# EAGLE design Triangular Ear Bass 21 (EAGLE 9.6.2)
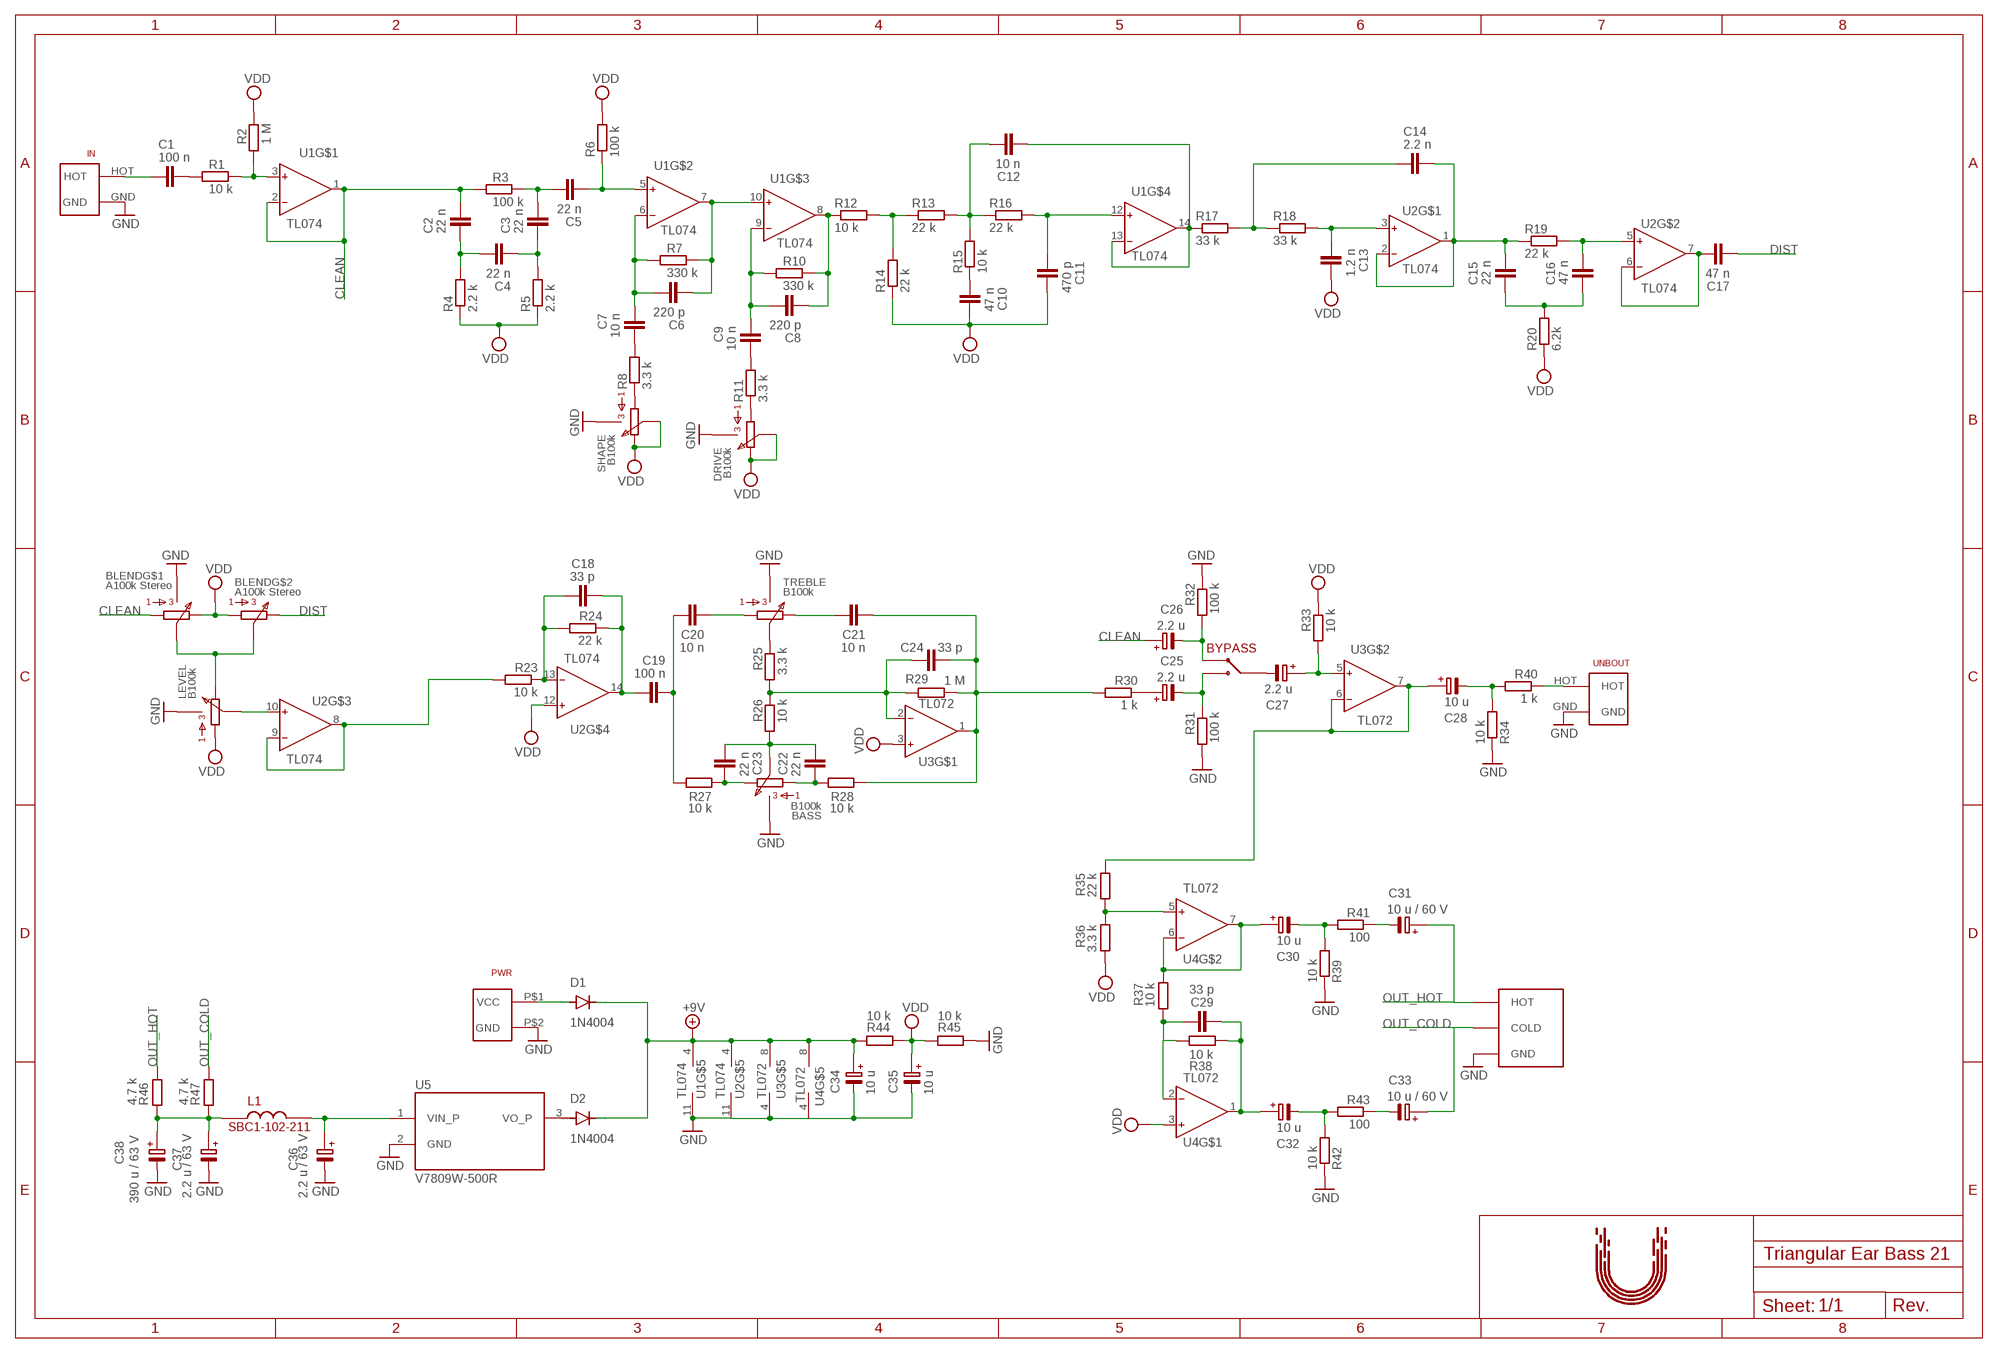
[diagram p0: schematic, sheet 1]

## Parts
BALOUT  HOT_COLD  [HOT_COLD]
BASS  B100k  RK09L1140  [RK09L1140]
BLEND  A100k Stereo  RK09L124000Z  [RK09L124000Z]
BYPASS  BUTTON  [3-HOLES]
C1  100 n  C-EU050-035X075  [C050-035X075]
C2  22 n  C-EU050-035X075  [C050-035X075]
C3  22 n  C-EU050-035X075  [C050-035X075]
C4  22 n  C-EU050-035X075  [C050-035X075]
C5  22 n  C-EU050-035X075  [C050-035X075]
C6  220 p  C-EU050-035X075  [C050-035X075]
C7  10 n  C-EU050-035X075  [C050-035X075]
C8  220 p  C-EU050-035X075  [C050-035X075]
C9  10 n  C-EU050-035X075  [C050-035X075]
C10  47 n  C-EU050-035X075  [C050-035X075]
C11  470 p  C-EU050-035X075  [C050-035X075]
C12  10 n  C-EU050-035X075  [C050-035X075]
C13  1.2 n  C-EU050-035X075  [C050-035X075]
C14  2.2 n  C-EU050-035X075  [C050-035X075]
C15  22 n  C-EU050-035X075  [C050-035X075]
C16  47 n  C-EU050-035X075  [C050-035X075]
C17  47 n  C-EU050-035X075  [C050-035X075]
C18  33 p  C-EU050-035X075  [C050-035X075]
C19  100 n  C-EU050-035X075  [C050-035X075]
C20  10 n  C-EU050-035X075  [C050-035X075]
C21  10 n  C-EU050-035X075  [C050-035X075]
C22  22 n  C-EU050-035X075  [C050-035X075]
C23  22 n  C-EU050-035X075  [C050-035X075]
C24  33 p  C-EU050-035X075  [C050-035X075]
C25  2.2 u  C-PR-2,0X5  [E2,0-5]
C26  2.2 u  C-PR-2,0X5  [E2,0-5]
C27  2.2 u  C-PR-2,0X5  [E2,0-5]
C28  10 u  C-PR-2,0X5  [E2,0-5]
C29  33 p  C-EU050-035X075  [C050-035X075]
C30  10 u  C-PR-2,0X5  [E2,0-5]
C31  10 u / 60 V  C-PR-2,0X5  [E2,0-5]
C32  10 u  C-PR-2,0X5  [E2,0-5]
C33  10 u / 60 V  C-PR-2,0X5  [E2,0-5]
C34  10 u  C-PR-2,0X5  [E2,0-5]
C35  10 u  C-PR-2,0X5  [E2,0-5]
C36  2.2 u / 63 V  C-PR-2,0X5  [E2,0-5]
C37  2.2 u / 63 V  C-PR-2,0X5  [E2,0-5]
C38  390 u / 63 V  C-PR-5,0X12,5  [E5,0-12,5]
D1  1N4004  [DO41-10]
D2  1N4004  [DO41-10]
DRIVE  B100k  RK09L1140  [RK09L1140]
IN  UNBALANCED_INPUT_JACK  [BALANCED_INPUT_JACK]
L1  SBC1-102-211  [SBC1-102-211]
LEVEL  B100k  RK09L1140  [RK09L1140]
PWR  PWR  [PWR]
R1  10 k  R-EU_0204/7  [0204/7]
R2  1 M  R-EU_0204/7  [0204/7]
R3  100 k  R-EU_0204/7  [0204/7]
R4  2.2 k  R-EU_0204/7  [0204/7]
R5  2.2 k  R-EU_0204/7  [0204/7]
R6  100 k  R-EU_0204/7  [0204/7]
R7  330 k  R-EU_0204/7  [0204/7]
R8  3.3 k  R-EU_0204/7  [0204/7]
R10  330 k  R-EU_0204/7  [0204/7]
R11  3.3 k  R-EU_0204/7  [0204/7]
R12  10 k  R-EU_0204/7  [0204/7]
R13  22 k  R-EU_0204/7  [0204/7]
R14  22 k  R-EU_0204/7  [0204/7]
R15  10 k  R-EU_0204/7  [0204/7]
R16  22 k  R-EU_0204/7  [0204/7]
R17  33 k  R-EU_0204/7  [0204/7]
R18  33 k  R-EU_0204/7  [0204/7]
R19  22 k  R-EU_0204/7  [0204/7]
R20  6.2k  R-EU_0204/7  [0204/7]
R23  10 k  R-EU_0204/7  [0204/7]
R24  22 k  R-EU_0204/7  [0204/7]
R25  3.3 k  R-EU_0204/7  [0204/7]
R26  10 k  R-EU_0204/7  [0204/7]
R27  10 k  R-EU_0204/7  [0204/7]
R28  10 k  R-EU_0204/7  [0204/7]
R29  1 M  R-EU_0204/7  [0204/7]
R30  1 k  R-EU_0204/7  [0204/7]
R31  100 k  R-EU_0204/7  [0204/7]
R32  100 k  R-EU_0204/7  [0204/7]
R33  10 k  R-EU_0204/7  [0204/7]
R34  10 k  R-EU_0204/7  [0204/7]
R35  22 k  R-EU_0204/7  [0204/7]
R36  3.3 k  R-EU_0204/7  [0204/7]
R37  10 k  R-EU_0204/7  [0204/7]
R38  10 k  R-EU_0204/7  [0204/7]
R39  10 k  R-EU_0204/7  [0204/7]
R40  1 k  R-EU_0204/7  [0204/7]
R41  100  R-EU_0204/7  [0204/7]
R42  10 k  R-EU_0204/7  [0204/7]
R43  100  R-EU_0204/7  [0204/7]
R44  10 k  R-EU_0204/7  [0204/7]
R45  10 k  R-EU_0204/7  [0204/7]
R46  4.7 k  R-EU_0204/7  [0204/7]
R47  4.7 k  R-EU_0204/7  [0204/7]
SHAPE  B100k  RK09L1140  [RK09L1140]
TREBLE  B100k  RK09L1140  [RK09L1140]
U1  TL074  TL074IDTPDIP-14  [DIP762W53P254L1969H508Q14B]
U2  TL074  TL074IDTPDIP-14  [DIP762W53P254L1969H508Q14B]
U3  TL072  TL072PDIP-8  [DIP762W53P254L980H508Q8B]
U4  TL072  TL072PDIP-8  [DIP762W53P254L980H508Q8B]
U5  V7809W-500R  [CONV_V7809W-500R]
U$1  UTBULT_DESIGN4  [UD_4]
UNBOUT  UNBALANCED_INPUT_JACK  [BALANCED_INPUT_JACK]

## Nets
48V: C37.+ C38.+ L1.P$1 R46.1 R47.1
+9V: C34.+ D1.C D2.C R44.1 U1.4(V+) U2.4(V+) U3.8(V+) U4.8(V+)
BLEND_OUT: R23.2 U2.8(OUT) U2.9(IN-)
CLEAN: BLEND.P$1 C2.2 C26.+ R3.1 U1.1(OUT) U1.2(IN-)
DIST: BLEND.P$8 C17.1
GND: BALOUT.P$1(GND) BASS.P$4 BASS.P$5 BLEND.P$4 BLEND.P$5 C34.- C35.- C36.- C37.- C38.- DRIVE.P$4 DRIVE.P$5 IN.GND LEVEL.P$4 LEVEL.P$5 PWR.P$2(GND) R31.2 R32.1 R34.1 R39.1 R42.1 R45.2 SHAPE.P$4 SHAPE.P$5 TREBLE.P$4 TREBLE.P$5 U1.11(V-) U2.11(V-) U3.4(V-) U4.4(V-) U5.2(GND) UNBOUT.GND
N$1: C1.1 IN.HOT
N$2: C1.2 R1.1
N$3: R1.2 R2.1 U1.3(IN+)
N$4: BLEND.P$2 BLEND.P$7 LEVEL.P$3
N$5: C2.1 C4.2 R4.2
N$6: C3.1 C4.1 R5.2
N$7: C3.2 C5.2 R3.2
N$8: C5.1 R6.1 U1.5(IN+)
N$9: C6.2 C7.1 R7.1 U1.6(IN-)
N$10: C6.1 R7.2 U1.7(OUT) U1.10(IN+)
N$11: C7.2 R8.2
N$12: R8.1 SHAPE.P$1
N$13: C8.2 C9.1 R10.1 U1.9(IN-)
N$14: C8.1 R10.2 R12.1 U1.8(OUT)
N$15: C9.2 R11.2
N$16: DRIVE.P$1 R11.1
N$17: C10.1 R15.1
N$18: R12.2 R13.1 R14.2
N$19: C12.2 R13.2 R15.2 R16.1
N$20: C11.1 R16.2 U1.12(IN+)
N$21: C14.1 R17.2 R18.1
N$22: C12.1 R17.1 U1.13(IN-) U1.14(OUT)
N$23: C13.1 R18.2 U2.3(IN+)
N$24: C14.2 C15.2 R19.1 U2.1(OUT) U2.2(IN-)
N$25: C16.2 R19.2 U2.5(IN+)
N$26: C15.1 C16.1 R20.2
N$29: C17.2 U2.6(IN-) U2.7(OUT)
N$30: LEVEL.P$2 U2.10(IN+)
N$31: C18.2 R23.1 R24.2 U2.13(IN-)
N$32: C18.1 C19.2 R24.1 U2.14(OUT)
N$33: C20.1 TREBLE.P$1
N$34: C21.2 TREBLE.P$3
N$35: C19.1 C20.2 R27.2
N$36: R25.1 TREBLE.P$2
N$37: C24.2 R25.2 R26.1 R29.1 U3.2(IN-)
N$38: BASS.P$3 C23.2 R27.1
N$39: BASS.P$2 C22.1 C23.1 R26.2
N$40: BASS.P$1 C22.2 R28.2
N$41: C25.+ R30.1
N$42: C21.1 C24.1 R28.1 R29.2 R30.2 U3.1(OUT)
N$43: BYPASS.P$3 C25.- R31.1
N$44: BYPASS.P$1 C26.- R32.2
N$45: BYPASS.P$2 C27.-
N$46: C27.+ R33.2 U3.5(IN+)
N$47: C28.+ R35.1 U3.6(IN-) U3.7(OUT)
N$48: C28.- R34.2 R40.2
N$49: R35.2 R36.1 U4.5(IN+)
N$51: C29.2 R37.2 R38.1 U4.2(IN-)
N$53: C30.+ R37.1 U4.6(IN-) U4.7(OUT)
N$54: C30.- R39.2 R41.2
N$55: R40.1 UNBOUT.HOT
N$56: C31.- R41.1
N$57: C29.1 C32.+ R38.2 U4.1(OUT)
N$58: C32.- R42.2 R43.2
N$59: C33.- R43.1
N$60: D1.A PWR.P$1(VCC)
N$61: D2.A U5.3(VO_P)
N$62: C36.+ L1.P$2 U5.1(VIN_P)
OUT_COLD: BALOUT.P$3(COLD) C33.+ R47.2
OUT_HOT: BALOUT.P$2(HOT) C31.+ R46.2
VDD: BLEND.P$3 BLEND.P$6 C10.2 C11.2 C13.2 C35.+ DRIVE.P$2 DRIVE.P$3 LEVEL.P$1 R2.2 R4.1 R5.1 R6.2 R14.1 R20.1 R33.1 R36.2 R44.2 R45.1 SHAPE.P$2 SHAPE.P$3 U2.12(IN+) U3.3(IN+) U4.3(IN+)

## Library data of the parts
BALOUT = connectors:HOT_COLD
BASS DRIVE LEVEL SHAPE TREBLE = passives:RK09L1140: RK09L1140 Potentiometer
BLEND = passives:RK09L124000Z: RK09L1140 Potentiometer
BYPASS = connectors:BUTTON
C1-C24 C29 = passives:C-EU: CAPACITOR, European symbol; SPICEPREFIX: C
C25-C28 C30-C38 = passives:C-PR: POLARIZED ELECTROLYTIC/TANTALUM
D1 D2 = passives:1N4004: DIODE general purpose rectifier, 1 A
IN UNBOUT = connectors:UNBALANCED_INPUT_JACK
L1 = passives:SBC1-102-211: SBC1-102-211 - Inductor 1 mH 210 mA
PWR = connectors:PWR
R1-R8 R10-R20 R23-R47 = passives:R-EU_: RESISTOR, European symbol; SPICEPREFIX: R
U1 U2 = ic:TL074IDT: Low noise JFET quad operational amplifier; LINK: https://eu.mouser.com/ProductDetail/Texas-Instruments/TL074CN?qs=%2Fha2pyFadui04%2FQQ4Z%2F%252B8cpHvrlLCfjGhhp9sdrT5Zo%3D; MPN: TL074CN; SUPPLIER: Mouser
U3 U4 = ic:TL072: Low noise JFET quad operational amplifier; LINK: https://www.mouser.se/ProductDetail/Texas-Instruments/TL072IP?qs=5BZzbFV4k2v7IBrcArRPQw%3D%3D; MPN: TL072IP; SUPPLIER: Mouser
U5 = ic:V7809W-500R: V7809W-500R Power regulator Input up to 72 V, output 9 V 500 mA; LINK: https://eu.mouser.com/ProductDetail/CUI-Inc/V7809W-500R?qs=WyjlAZoYn50ZQqVm%2FTcinw%3D%3D; MPN: V7809W-500R; SUPPLIER: Mouser
U$1 = misc:UTBULT_DESIGN

## Board
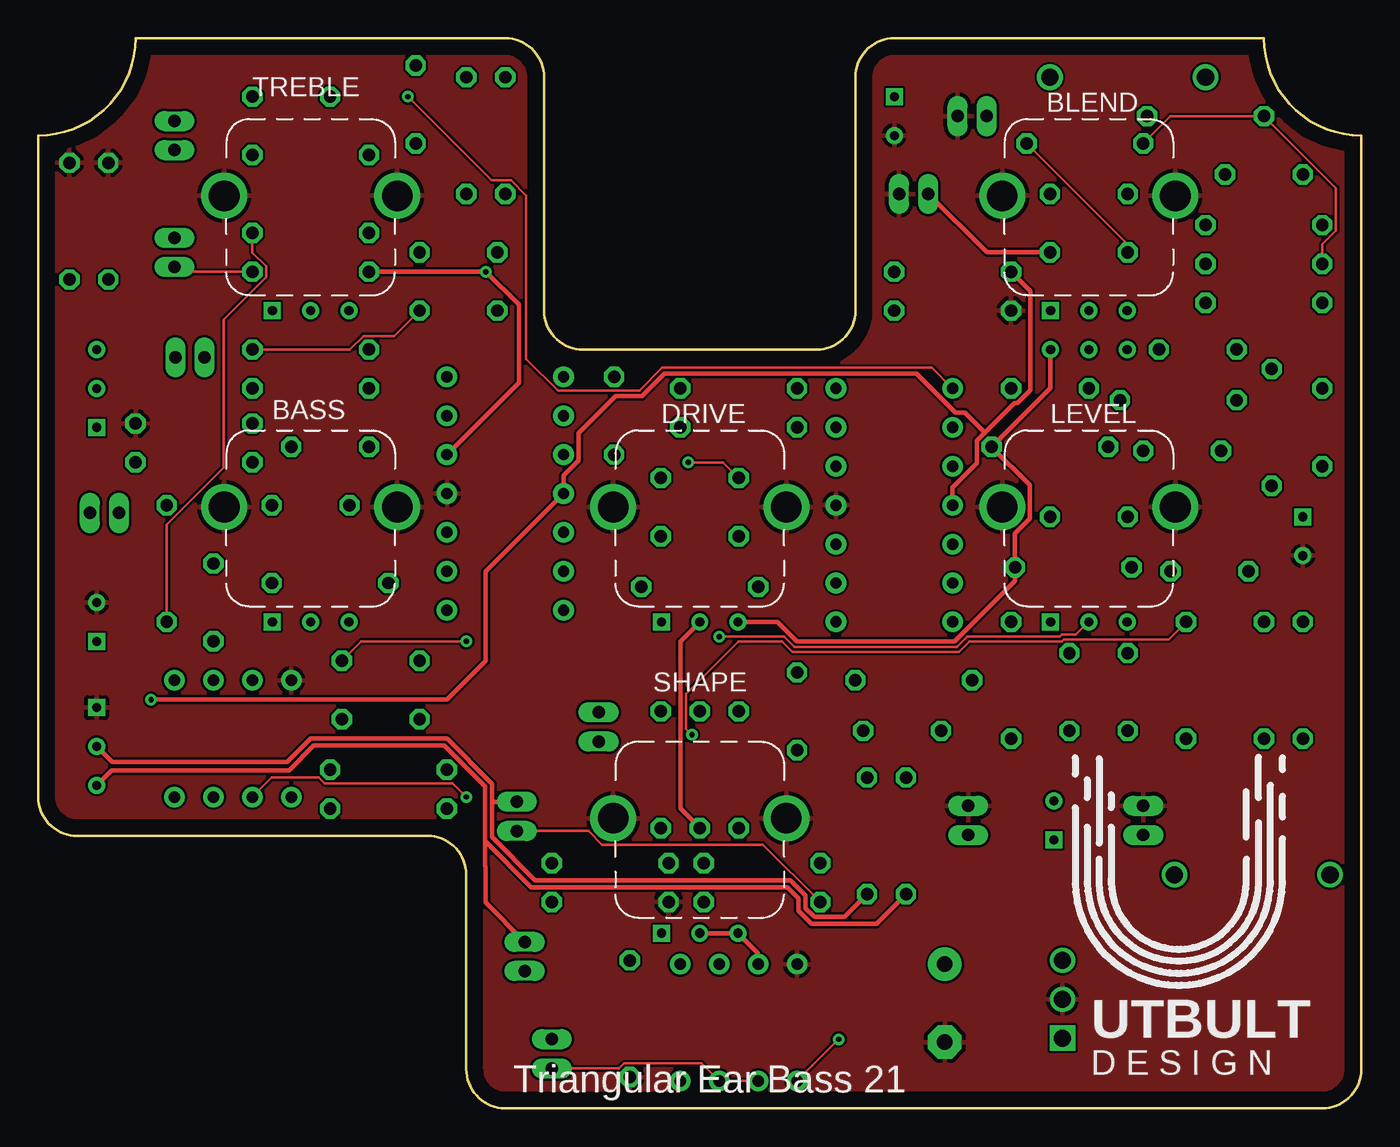
[diagram p1: board, top side]
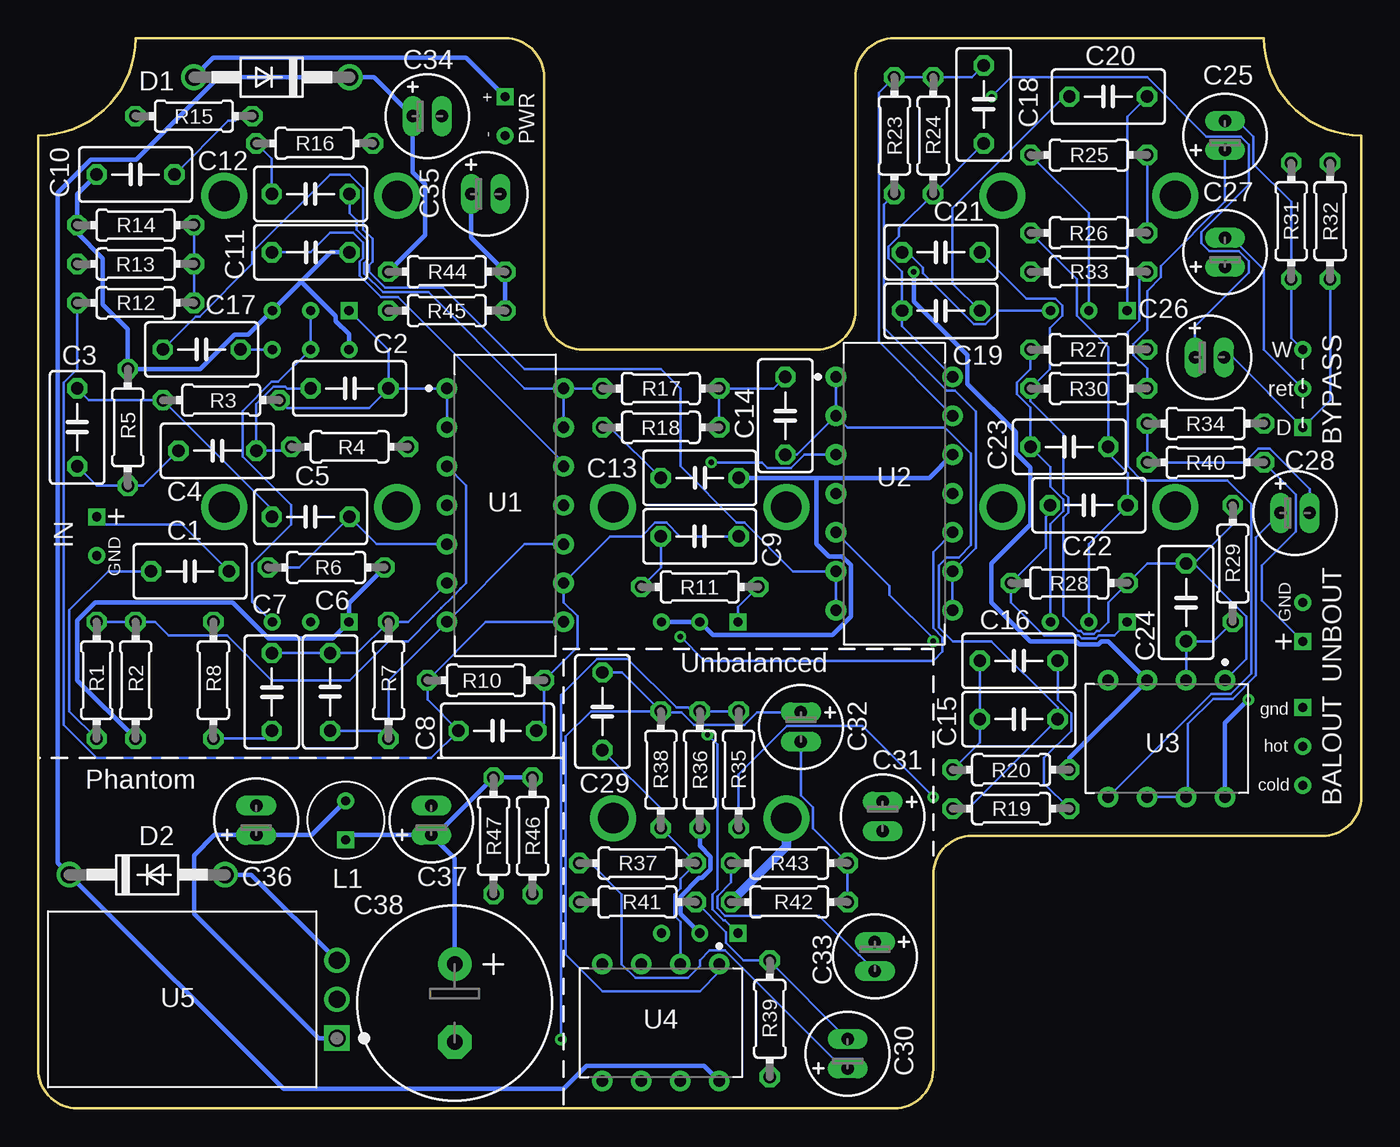
[diagram p2: board, bottom side, seen from below]

Size 86.36 x 69.85 mm. Coordinates in mm from the lower left corner, seen from the top.
Outline: 6.35,69.85 arc-90 0,63.5 0,20.32 arc90 2.54,17.78 25.4,17.78 arc-90 27.94,15.24 27.94,2.54 arc90 30.48,0 83.82,0 arc90 86.36,2.54 86.36,63.5 arc-90 80.01,69.85 55.88,69.85 arc90 53.34,67.31 53.34,52.07 arc-90 50.8,49.53 35.56,49.53 arc-90 33.02,52.07 33.02,67.31 arc90 30.48,69.85 6.35,69.85
Copper layers (1*16): Top 0.035mm / dielectric 1.5mm / Bottom 0.035mm
Design rules "default": minimum track width 6mil, minimum drill 0.35mm, track to track 6mil, track to pad 6mil, pad to pad 6mil, via to via 6mil, smd to smd 6mil, copper to edge 40mil, drill to drill 6mil, minimum pad ring 10mil, minimum via ring 8mil, stop-mask expansion 4mil, vias tented up to drill 0mil, thermal gap 10mil

### Footprints (pad centres in the part's own frame; a part is rotated, then mirrored left to right if it is on the bottom)
HOT_COLD = drill 0.6 square: P$1 -2.54,0 | drill 0.6: P$2 0,0; P$3 2.54,0
RK09L1140 = drill 0.6 square: P$1 -2.5,0 | drill 0.6: P$2 0,0; P$3 2.5,0 | drill 2: P$4 -5.65,7.5; P$5 5.65,7.5
RK09L124000Z = drill 0.6 square: P$1 -2.5,0 | drill 0.6: P$2 0,0; P$3 2.5,0; P$6 -2.5,-2.54; P$7 0,-2.54; P$8 2.5,-2.54 | drill 2: P$4 -5.65,7.5; P$5 5.65,7.5
3-HOLES = drill 0.6 square: P$1 -2.54,0 | drill 0.6: P$2 0,0; P$3 2.54,0
C050-035X075 = drill 0.813 octagon: 1 -2.54,0; 2 2.54,0
E2,0-5 = drill 0.813 long: + -0.953,0; - 0.953,0
E5,0-12,5 = drill 1.016 pad 2.184: + -2.54,0 | drill 1.016 pad 2.184 octagon: - 2.54,0
DO41-10 = drill 1.118: A 5.08,0; C -5.08,0
BALANCED_INPUT_JACK = drill 0.6: GND 1.27,0 | drill 0.6 square: HOT -1.27,0
SBC1-102-211 = drill 0.6 square: P$1 -1.27,0 | drill 0.6: P$2 1.27,0
PWR = drill 0.6 square: P$1 -1.27,0 | drill 0.6: P$2 1.27,0
0204/7 = drill 0.813 octagon: 1 -3.81,0; 2 3.81,0
DIP762W53P254L1969H508Q14B = drill 0.743 pad 1.343: 1 -3.81,7.62; 2 -3.81,5.08; 3 -3.81,2.54; 4 -3.81,0; 5 -3.81,-2.54; 6 -3.81,-5.08; 7 -3.81,-7.62; 8 3.81,-7.62; 9 3.81,-5.08; 10 3.81,-2.54; 11 3.81,0; 12 3.81,2.54; 13 3.81,5.08; 14 3.81,7.62
DIP762W53P254L980H508Q8B = drill 0.743 pad 1.343: 1 -3.81,3.81; 2 -3.81,1.27; 3 -3.81,-1.27; 4 -3.81,-3.81; 5 3.81,-3.81; 6 3.81,-1.27; 7 3.81,1.27; 8 3.81,3.81
CONV_V7809W-500R = drill 1.1 square: 1 -10.1,2.54 | drill 1.1: 2 -10.1,0; 3 -10.1,-2.54

### Placement (x,y rotation side)
BALOUT  3.81,23.62 270 bottom
BASS  17.78,31.75 0 top
BLEND  68.58,52.07 0 top
BYPASS  3.81,46.99 90 bottom
C1  76.45,35.05 180 bottom
C2  66.04,46.99 0 bottom
C3  83.82,44.45 90 bottom
C4  74.68,42.93 0 bottom
C5  68.58,38.61 180 bottom
C6  67.31,27.18 90 bottom
C7  71.12,27.18 270 bottom
C8  56.39,24.64 0 bottom
C9  43.18,37.34 180 bottom
C10  80.01,60.96 180 bottom
C11  68.58,55.88 0 bottom
C12  68.58,59.69 180 bottom
C13  43.18,41.15 0 bottom
C14  37.59,45.21 270 bottom
C15  22.35,25.4 0 bottom
C16  22.35,29.21 0 bottom
C17  75.69,49.53 180 bottom
C18  24.64,65.53 90 bottom
C19  27.43,52.07 180 bottom
C20  16.51,66.04 180 bottom
C21  27.43,55.88 180 bottom
C22  17.78,39.37 180 bottom
C23  19.05,43.18 180 bottom
C24  11.43,33.02 270 bottom
C25  8.89,63.5 90 bottom
C26  9.91,49.02 0 bottom
C27  8.89,55.88 90 bottom
C28  4.32,38.86 0 bottom
C29  49.53,25.91 270 bottom
C30  33.53,3.56 90 bottom
C31  31.24,19.05 270 bottom
C32  36.58,24.89 270 bottom
C33  31.75,9.91 270 bottom
C34  60.96,64.77 0 bottom
C35  57.15,59.69 0 bottom
C36  72.14,18.8 90 bottom
C37  60.71,18.8 90 bottom
C38  59.18,6.86 270 bottom
D1  71.12,67.31 180 bottom
D2  79.25,15.24 0 bottom
DRIVE  43.18,31.75 0 top
IN  82.55,37.34 270 bottom
L1  66.29,18.8 90 bottom
LEVEL  68.58,31.75 0 top
PWR  55.88,64.77 270 bottom
R1  82.55,27.94 90 bottom
R2  80.01,27.94 270 bottom
R3  74.42,46.23 180 bottom
R4  66.04,43.18 180 bottom
R5  80.52,44.45 270 bottom
R6  67.56,35.31 0 bottom
R7  63.5,27.94 270 bottom
R8  74.93,27.94 270 bottom
R10  57.15,27.94 180 bottom
R11  43.18,34.04 180 bottom
R12  80.01,52.58 0 bottom
R13  80.01,55.12 180 bottom
R14  80.01,57.66 0 bottom
R15  76.2,64.77 180 bottom
R16  68.33,62.99 0 bottom
R17  45.72,46.99 0 bottom
R18  45.72,44.45 180 bottom
R19  22.86,19.56 0 bottom
R20  22.86,22.1 180 bottom
R23  30.48,63.5 270 bottom
R24  27.94,63.5 90 bottom
R25  17.78,62.23 0 bottom
R26  17.78,57.15 180 bottom
R27  17.78,49.53 0 bottom
R28  19.05,34.29 180 bottom
R29  8.38,35.56 90 bottom
R30  17.78,46.99 180 bottom
R31  4.57,57.91 90 bottom
R32  2.03,57.91 270 bottom
R33  17.78,54.61 0 bottom
R34  10.16,44.7 180 bottom
R35  40.64,22.1 90 bottom
R36  43.18,22.1 270 bottom
R37  47.24,16 0 bottom
R38  45.72,22.1 90 bottom
R39  38.61,5.84 90 bottom
R40  10.16,42.16 180 bottom
R41  47.24,13.46 0 bottom
R42  37.34,13.46 0 bottom
R43  37.34,16 0 bottom
R44  59.69,54.61 0 bottom
R45  59.69,52.07 180 bottom
R46  54.1,17.78 270 bottom
R47  56.64,17.78 270 bottom
SHAPE  43.18,11.43 0 top
TREBLE  17.78,52.07 0 top
U1  55.88,39.37 0 bottom
U2  30.48,40.13 0 bottom
U3  12.7,24.13 270 bottom
U4  45.72,5.59 270 bottom
U5  76.96,7.11 180 bottom
U$1  74.42,16 0 top
UNBOUT  3.81,31.75 90 bottom

### Tracks (layer width: path | path; a pad name or v marks a point on that pad's centre or on a via)
48V
  Bottom 0.305: R46.1 R47.1 60.39,17.84 C37.+ | C37.+ 59.18,16.32 C38.+ | C37.+ 65.98,17.84 L1.P$1
+9V  (via drill 0.35)
  Top 0.305: U1.4 59.69,40.53 61.27,42.1 61.27,43.58 61.79,44.11 | 61.79,44.11 63.71,46.02 63.9,46.02 64.77,46.9 64.77,53.34 R44.1 | 61.79,44.11 60.48,45.43 59.87,45.43 57.33,47.97 40.88,47.97 39.4,46.48 37.69,46.48 35.27,44.06 35.27,42.27 34.29,41.29 U2.4 29.21,35.05 29.21,29.21 26.67,26.67 v7.37,26.67
  Bottom 0.305: R44.1 61.12,56.98 61.12,60.32 61.91,61.1 C34.+ 64.45,67.31 D1.C 74.58,67.31 79.97,61.92 82.95,61.92 85.09,59.78 85.09,16 D2.C 70.36,1.27 52.07,1.27 50.59,2.75 42.89,2.75 U4.8 | v7.37,26.67 8.89,25.15 U3.8
BLEND_OUT
  Bottom 0.152: R23.2 31.17,59 31.17,50.98 27.04,46.85 26.53,46.85 25.16,45.48 25.16,36.56 U2.9 U2.8
CLEAN  (via drill 0.35)
  Top 0.152: v24.13,66.04 29.59,60.58 30.85,60.58 31.85,59.58 31.85,48.92 33.92,46.85 34.66,46.85 34.67,46.86 39.24,46.86 40.73,48.35 58.33,48.35 U1.1
  Bottom 0.152: U1.2 U1.1 C2.2 | C2.2 64.77,45.72 70.1,45.72 R3.1 | C2.2 63.5,49.49 BLEND.P$1 | C26.+ 10.86,51.04 7.34,54.56 7.34,55.3 7.99,55.94 9.92,55.94 10.44,56.46 10.44,57.2 7.34,60.3 7.34,62.92 7.86,63.44 10.1,63.44 13.97,67.31 22.86,67.31 v24.13,66.04
DIST
  Bottom 0.152: BLEND.P$8 C17.1
GND
  Bottom 0.61: SHAPE.P$4 37.53,17.08 R42.1
  pour Top: 0,69.85 0,17.78 25.4,17.78 27.94,15.24 27.94,0 86.36,0 86.36,63.5 80.01,69.85 53.34,69.85 53.34,52.07 50.8,49.53 35.56,49.53 33.02,52.07 33.02,69.85
N$1
  Bottom 0.152: IN.HOT 82.04,38.1 76.96,38.1 C1.1
N$2
  Bottom 0.152: C1.2 81.79,35.05 84.33,32.51 84.33,25.91 R1.1
N$3
  Bottom 0.152: R1.2 R2.1 78.73,31.75 77.84,30.86 74.04,30.86 71.12,27.94 66.04,27.94 63.5,30.48 62.23,30.48 60.59,32.12 60.06,32.65 59.32,33.39 58.79,33.92 58.42,34.29 58.42,40.64 U1.3
N$4
  Bottom 0.152: BLEND.P$2 BLEND.P$7 70.69,47.42 71.12,47.42 73.03,45.52 73.03,42.56 69.85,39.38 69.85,38.1 72.39,35.56 72.39,33.06 LEVEL.P$3
N$5
  Bottom 0.152: R4.2 70.1,42.93 C4.2 72.14,45.97 70.99,47.12 70.24,47.12 70.12,46.99 C2.1
N$6
  Bottom 0.152: C3.1 82.55,40.64 R5.2 79.5,40.64 C4.1
N$7
  Bottom 0.152: C3.2 83.06,46.23 R3.2 71.12,39.12 C5.2
N$8
  Bottom 0.152: R6.1 69.34,35.31 C5.1 64.26,36.83 U1.5
N$9
  Bottom 0.152: U1.6 62.23,31.75 R7.1 65.53,29.72 C6.2 C7.1
N$10
  Bottom 0.152: C6.1 64.01,24.64 R7.2 63.5,27.94 U1.7 54.61,36.83 U1.10
N$11
  Bottom 0.152: R8.2 71.63,24.13 C7.2
N$12  (via drill 0.35)
  Top 0.152: R8.1 73.79,30.61 66.94,30.61 66.81,30.48 60.77,30.48 60.09,29.79 49.25,29.79 48.56,30.48 45.72,30.48 42.29,27.05 42.29,24.77 v42.67,24.38
  Bottom 0.152: v42.67,24.38 42.04,23.75 42.04,14.27 42.34,13.97 42.34,12.97 41.64,12.27 41.52,12.27 SHAPE.P$1
N$13
  Bottom 0.152: C8.2 53.34,25.15 R10.1 51.17,30.11 51.17,32.12 52.07,33.02 U1.9 49.02,37.34 46.98,37.34 46.09,38.23 45.35,38.23 44.46,37.34 C9.1
N$14
  Bottom 0.152: U1.8 57.15,31.75 R10.2 60.96,26.67 C8.1 60.71,22.86 82.55,22.86 84.71,25.02 84.71,47.36 83.82,48.25 R12.1
N$15
  Bottom 0.152: R11.2 45.72,35.31 C9.2
N$16
  Bottom 0.152: R11.1 40.68,32.73 DRIVE.P$1
N$17
  Bottom 0.152: R15.1 73.22,64.77 73.52,64.47 73.97,64.47 C10.1
N$18
  Bottom 0.152: R14.2 R13.1 R12.2
N$19
  Top 0.152: R13.2 83.82,56.4 84.71,57.29 84.71,60.07 R15.2 73.91,64.77 R16.1
  Bottom 0.152: C12.2 71.12,61.98 R16.1
N$20
  Top 0.152: R16.2 71.12,56.39 C11.1
  Bottom 0.152: U1.12 52.07,42.16 62.87,52.96 63.98,52.96 65.38,54.36 65.38,55.28 65.15,55.51 65.15,56.5 65.8,57.15 67.31,57.15 68.58,55.88 C11.1
N$21
  Bottom 0.152: C14.1 38.35,46.99 R17.2 R18.1
N$22
  Bottom 0.152: R17.1 U1.14 | U1.14 U1.13 | C12.1 66.04,58.42 65.58,57.96 65.58,57.37 64.85,56.63 64.85,55.39 65.08,55.16 65.08,54.48 63.85,53.26 60.88,53.26 54.61,46.99 U1.14
N$23  (via drill 0.35)
  Top 0.152: v42.42,42.16 44.7,42.16 C13.1
  Bottom 0.152: C13.1 49.02,44.45 R18.2 | U2.3 36.34,42.67 37.22,41.78 38.75,41.78 39.13,42.16 v42.42,42.16
N$24
  Bottom 0.152: U2.1 U2.2 | U2.2 36.83,42.67 C14.2 | R19.1 25.65,19.56 C15.2 19.81,26.16 24.13,30.48 26.65,30.48 27.57,31.4 27.57,35.42 27.04,35.95 26.28,35.95 25.46,36.77 25.46,42.74 27.18,44.45 33.53,44.45 U2.2
N$25  (via drill 0.35)
  Top 0.152: C16.2 21.08,30.48 v27.94,30.48
  Bottom 0.152: R19.2 20.7,21.21 20.7,22.86 18.92,24.64 18.92,25.77 19.81,26.66 C16.2 | U2.5 30.79,34.09 30.79,33.5 27.94,30.66 v27.94,30.48
N$26
  Bottom 0.152: R20.2 24.89,23.88 C15.1 C16.1
N$29
  Bottom 0.152: C17.2 76.07,51.69 75.83,51.69 72.39,55.13 72.39,55.88 67.31,60.96 66.04,60.96 66.04,60.95 65.15,60.06 65.15,57.36 64.54,56.76 64.54,55.26 64.77,55.03 64.77,54.62 63.72,53.57 59.92,53.57 54.61,48.26 45.72,48.26 44.45,46.99 44.45,41.91 40.77,38.23 40.27,38.23 37.1,35.05 U2.6 U2.7
N$30  (via drill 0.35)
  Top 0.152: LEVEL.P$2 67.74,30.91 66.82,30.91 66.69,30.79 60.65,30.79 59.96,30.1 49.37,30.1 48.69,30.79 v44.45,30.79
  Bottom 0.152: U2.10 27.94,36.32 27.94,31.34 27.33,30.73 27.33,29.82 27.94,29.21 42.88,29.21 v44.45,30.79
N$31
  Bottom 0.152: C18.2 25.4,67.31 R24.2 R23.1 31.5,66.29 31.5,50.04 U2.13
N$32
  Bottom 0.152: C18.1 R24.1 30.18,57.45 30.18,56.93 30.86,56.25 30.86,55.51 29.97,54.62 C19.2 29.97,51.05 U2.14
N$33
  Bottom 0.152: C20.1 15.28,64.73 TREBLE.P$1
N$34
  Bottom 0.152: TREBLE.P$3 23.64,52.07 24.52,51.18 25.27,51.18 28.6,54.51 28.6,54.86 29.62,55.88 C21.2
N$35
  Top 0.152: C19.1 23.24,50.42 21.22,50.42 20.33,49.53 R27.2
  Bottom 0.152: C20.2 19.41,66.04 26.67,58.77 26.67,53.85 C19.1
N$36
  Bottom 0.152: TREBLE.P$2 17.78,58.42 R25.1
N$37
  Top 0.152: R26.1 13.97,55.87 14.86,54.98 14.86,54.24 12.09,51.48 12.09,41.82 8.38,38.11 R29.1
  Bottom 0.152: R29.1 9.65,30.48 C24.2 U3.2 | R26.1 R25.2
N$38
  Bottom 0.152: R27.1 21.59,48.25 22.48,47.36 22.48,46.62 21.59,45.73 C23.2 20.28,41.87 20.28,40.59 19.43,39.74 19.43,39 20.28,38.15 BASS.P$3
N$39
  Bottom 0.152: R26.2 18.56,54.12 18.56,51.75 16.51,49.69 C23.1 16.51,42.75 15.24,41.48 C22.1 17.78,36.83 BASS.P$2
N$40
  Bottom 0.152: C22.2 20.32,38.87 20.59,38.61 20.59,36.56 R28.2 22.86,33.02 20.7,30.86 18.43,30.86 18.23,30.66 17.33,30.66 17.13,30.86 16.13,30.86 15.28,31.71 BASS.P$1
N$41
  Bottom 0.152: R30.1 13.97,48.27 14.86,49.16 14.86,49.9 13.97,50.79 13.97,53.35 13.08,54.24 13.08,54.99 8.89,59.18 C25.+
N$42
  Bottom 0.152: 10.94,35.56 C24.1 13.97,35.56 R28.1 16.51,33.02 16.51,31.75 17.09,31.17 17.26,31.17 17.46,30.97 18.1,30.97 18.3,31.17 18.47,31.17 19.43,32.13 19.43,38.57 19.13,38.88 19.13,39.86 19.43,40.17 19.43,44.01 21.59,46.16 R30.2 20.32,48.26 20.32,50.92 19.5,51.75 19.5,52.39 19.96,52.85 21.86,52.85 C21.1 | R29.2 8.38,38.11 10.94,35.56 | U3.1 7.49,29.34 7.49,32.12 10.94,35.56
N$43
  Bottom 0.152: BYPASS.P$3 4.57,50.29 R31.1 4.57,59.18 7.04,61.65 7.04,63.42 8.06,64.45 C25.-
N$44
  Bottom 0.152: C26.- 8.38,49.02 BYPASS.P$1 2.03,46.23 R32.2
N$45
  Bottom 0.152: BYPASS.P$2 6.35,49.53 6.35,54.74 8.45,56.83 C27.-
N$46
  Top 0.152: C27.+ 9.21,54.61 R33.2
  Bottom 0.152: U3.5 9.79,27.04 8.52,27.04 7.19,28.37 7.19,39.43 8.73,40.98 14.31,40.98 15.24,41.91 15.24,50.68 14.5,51.42 14.5,54.08 R33.2
N$47  (via drill 0.35)
  Top 0.152: U3.6 15.24,21.59 18.3,21.59 18.68,21.21 27.05,21.21 v27.94,20.32
  Bottom 0.152: C28.+ 6.88,37.25 6.88,28.24 8.39,26.73 9.66,26.73 11.3,25.1 11.3,20.45 U3.7 U3.6 | v27.94,20.32 32.58,24.96 37.48,24.96 40.64,21.79 R35.1
N$48
  Bottom 0.152: R34.2 R40.2 7.62,42.16 6.73,43.05 5.98,43.05 3.37,40.44 C28.-
N$49  (via drill 0.35)
  Top 0.152: U4.5 50.55,2.79 v52.25,4.5
  Bottom 0.152: R35.2 R36.1 43.7,25.91 43.94,26.15 44.7,26.15 47.89,29.34 49.9,29.34 52.25,26.99 v52.25,4.5
N$51
  Bottom 0.152: C29.2 45.72,19.56 R38.1 R37.2 44.45,14.99 44.45,14.35 44.83,13.97 44.83,12.54 44.45,12.16 U4.2
N$53
  Top 0.152: U4.6 U4.7 43.31,2.92 38.24,2.92 37.92,2.6 C30.+
  Bottom 0.152: C30.+ 33.84,2.6 41.54,10.3 42.53,10.3 43.17,9.66 43.17,9.28 43.95,8.5 47.36,8.5 48.27,9.41 48.27,13.98 50.3,16 R37.1
N$54
  Bottom 0.152: R41.2 41.46,11.49 41.46,10.78 40.33,9.65 R39.2 38.61,9.59 C30.-
N$55
  Bottom 0.152: UNBOUT.HOT 6.49,33.16 6.49,35.42 4.25,37.66 4.25,40.07 R40.1
N$56
  Top 0.152: C31.- 35.92,18.1 36.81,17.2 47.31,17.2 R41.1
N$57
  Bottom 0.152: R38.2 48.26,28.45 C29.1 | R38.2 50.29,25.91 51.94,24.26 51.94,10.03 49.53,7.62 43.18,7.62 41.91,8.89 U4.1 | R38.2 45.66,25.84 44.37,25.84 43.55,25.02 40.27,25.02 39.45,25.84 C32.+
N$58
  Bottom 0.152: R42.2 R43.2 35.8,18.27 35.8,19.65 36.58,20.42 C32.-
N$59
  Bottom 0.152: C33.- 32.77,9.97 32.78,9.97 35.38,12.57 41.52,12.57 42.04,13.09 42.04,13.84 41.15,14.73 R43.1
N$60
  Bottom 0.305: PWR.P$1 58.42,68.58 74.93,68.58 D1.A
N$61
  Bottom 0.305: U5.3 72.45,15.24 D2.A
N$62
  Bottom 0.305: L1.P$2 68.52,17.84 C36.+ 74.87,17.84 76.2,16.51 76.2,12.7 68.07,4.57 U5.1
OUT_COLD
  Top 0.305: BALOUT.P$3 4.79,22.06 16.38,22.06 17.99,23.67 26.48,23.67 29.16,20.99 29.16,17.45 | 29.16,17.45 32.18,14.43 48.9,14.43 49.63,13.7 49.63,12.87 50.47,12.04 54.71,12.04 R47.2 | 29.16,17.45 29.16,15.78 29.18,15.76 29.18,13.42 C33.+
OUT_HOT
  Top 0.305: BALOUT.P$2 4.83,22.61 16.26,22.61 17.78,24.13 26.67,24.13 29.62,21.18 29.62,20 | 29.62,20 C31.+ | 29.62,20 29.62,17.7 32.43,14.88 49.09,14.88 50.09,13.89 50.09,13.06 50.65,12.5 52.63,12.5 R46.2
VDD  (via drill 0.35)
  Top 0.305: C11.2 61.91,55.88 C35.+ | BLEND.P$6 66.08,47.03 R4.1 64.73,40.67 64.73,38.5 63.75,37.52 R6.2 63.75,34.43 59.8,30.48 49.53,30.48 48.26,31.75 DRIVE.P$3 | R33.1 v29.21,54.61 31.37,52.45 31.37,47.37 U2.12 | SHAPE.P$2 SHAPE.P$3 46.99,10.12 U4.3 | R36.2 41.91,19.56 41.91,30.48 DRIVE.P$2
  Bottom 0.305: C10.2 83.82,59.69 R14.1 83.82,57.15 82.14,55.47 82.14,52.48 80.52,50.85 R5.1 75.79,48.26 73.55,50.49 72.66,50.49 BLEND.P$3 69.19,53.95 | C11.2 67.27,55.88 69.19,53.95 | 69.19,53.95 66.94,51.7 66.94,51.39 66.08,50.53 BLEND.P$6 | C35.+ 58.1,56.83 R44.2 R45.1 | R6.2 66.08,32.98 LEVEL.P$1 67.15,30.68 71.32,30.68 73.66,33.02 82.64,33.02 83.82,31.84 83.82,27.94 R2.2 | 35.56,41.15 28.19,41.15 U2.12 | 35.56,41.15 C13.2 | 35.56,41.15 35.56,36.83 34.76,36.03 33.89,36.03 33.31,35.46 33.31,32.11 34.53,30.89 42.32,30.89 DRIVE.P$2 DRIVE.P$3 | R20.1 19.05,22.86 U3.3 16.51,30.48 16.97,30.48 17.17,30.28 18.39,30.28 18.59,30.48 21.59,30.48 24.13,33.02 24.13,35.56 21.59,38.1 21.59,41.81 22.55,42.78 22.55,44.15 25.69,47.28 25.69,49.16 29.21,52.67 v29.21,54.61 | R36.2 43.18,17.11 42.47,16.4 42.47,15.6 43.03,15.04 43.22,15.04 44.45,13.81 44.45,12.7 SHAPE.P$2

### Text on the board
tPlace: Triangular Ear Bass 21
bPlace: W | ret | D | Unbalanced | BALOUT | Phantom